# EAGLE design OSSM-M5-Remote_v1 (EAGLE 9.7.0)
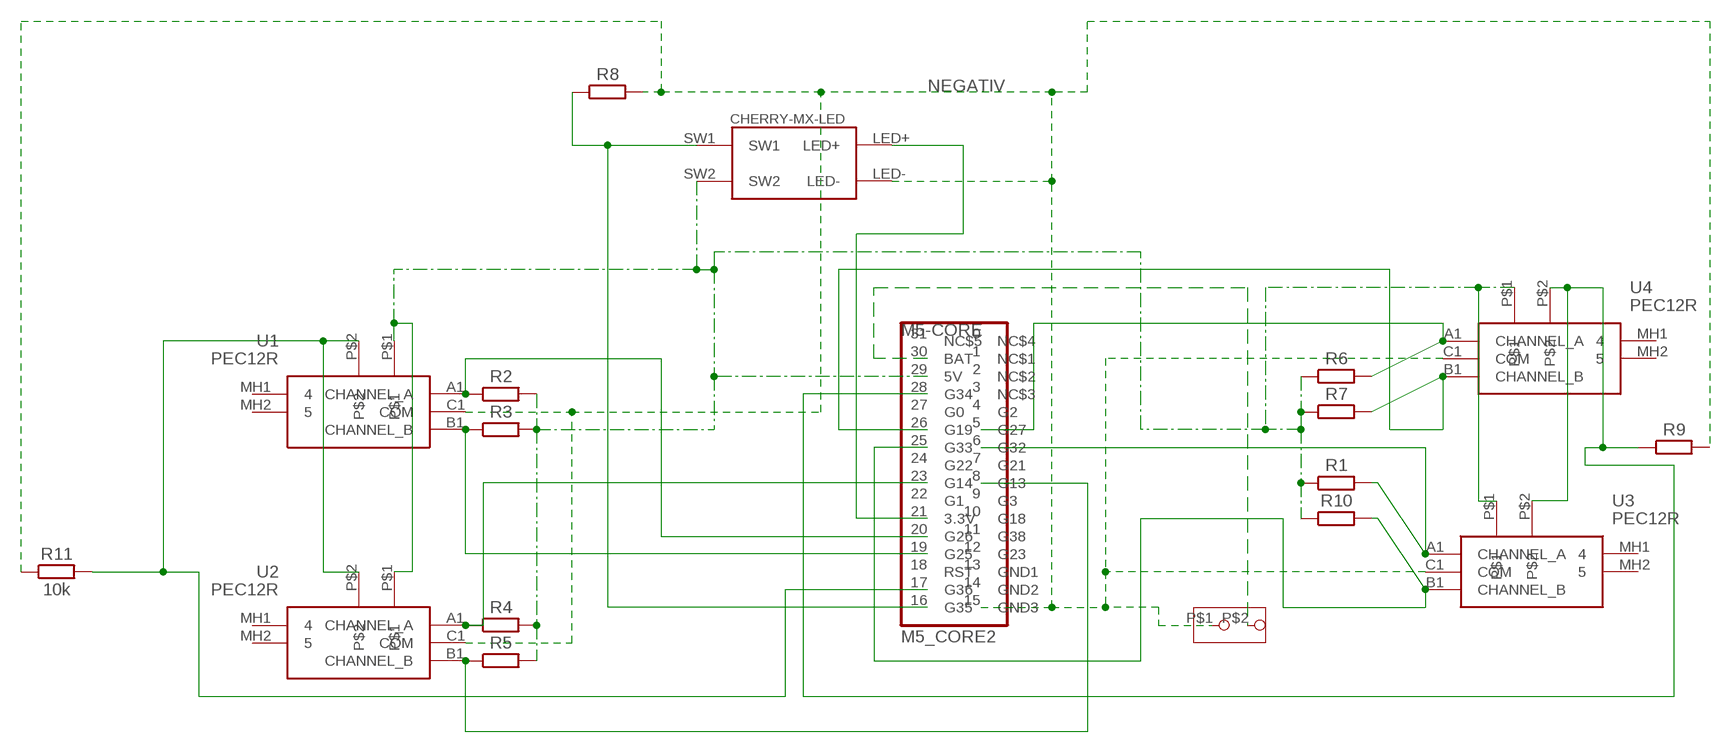
[diagram p0: schematic, sheet 1]

## Parts
M5-CORE  M5_CORE2  [M5_CORE2]
R1  R_CHIP-1206(3216-METRIC)  [RESC3216X70]
R2  R_CHIP-1206(3216-METRIC)  [RESC3216X70]
R3  R_CHIP-1206(3216-METRIC)  [RESC3216X70]
R4  R_CHIP-1206(3216-METRIC)  [RESC3216X70]
R5  R_CHIP-1206(3216-METRIC)  [RESC3216X70]
R6  R_CHIP-1206(3216-METRIC)  [RESC3216X70]
R7  R_CHIP-1206(3216-METRIC)  [RESC3216X70]
R8  R_CHIP-1206(3216-METRIC)  [RESC3216X70]
R9  R_CHIP-1206(3216-METRIC)  [RESC3216X70]
R10  R_CHIP-1206(3216-METRIC)  [RESC3216X70]
R11  10k  R_CHIP-1206(3216-METRIC)  [RESC3216X70]
U1  PEC12R  PEC12R-4230F-N0024  [PEC12R4017FN0024]
U2  PEC12R  PEC12R-4230F-N0024  [PEC12R4017FN0024]
U3  PEC12R  PEC12R-4230F-N0024  [PEC12R4017FN0024]
U4  PEC12R  PEC12R-4230F-N0024  [PEC12R4017FN0024]
U$3  JST-PH-2MM,180  [JST-PH-2.0MM_180DEGREES]
U$4  CHERRY-MX-LED  [CHERRY-MX-LED]

## Nets
+5V [Power]: M5-CORE.29(5V) R1.1 R2.2 R3.2 R4.2 R5.2 R6.1 R7.1 R10.1 U1.P$1 U2.P$1 U3.P$1 U4.P$1 U$4.SW2
BAT+ [Power]: M5-CORE.30(BAT) U$3.P$2
N$3: M5-CORE.21(3.3V) U$4.LED+
N$5: M5-CORE.20(G26) R2.1 U1.A1(CHANNEL_A)
N$6: M5-CORE.19(G25) R3.1 U1.B1(CHANNEL_B)
N$8: M5-CORE.23(G14) R4.1 U2.A1(CHANNEL_A)
N$10: M5-CORE.8(G13) R5.1 U2.B1(CHANNEL_B)
N$11: M5-CORE.5(G27) R6.2 U4.A1(CHANNEL_A)
N$12: M5-CORE.26(G19) R7.2 U4.B1(CHANNEL_B)
N$13: M5-CORE.6(G32) R1.2 U3.A1(CHANNEL_A)
N$14: M5-CORE.25(G33) R10.2 U3.B1(CHANNEL_B)
N$26: M5-CORE.17(G36) R11.2 U1.P$2 U2.P$2
N$27: M5-CORE.28(G34) R9.1 U3.P$2 U4.P$2
N$31: M5-CORE.16(G35) R8.1 U$4.SW1
NEGATIV [Power]: M5-CORE.15(GND3) R8.2 R9.2 R11.1 U1.C1(COM) U2.C1(COM) U3.C1(COM) U4.C1(COM) U$3.P$1 U$4.LED-
Unconnected: M5-CORE.0(NC$4) M5-CORE.1(NC$1) M5-CORE.2(NC$2) M5-CORE.3(NC$3) M5-CORE.4(G2) M5-CORE.7(G21) M5-CORE.9(G3) M5-CORE.10(G18) M5-CORE.11(G38) M5-CORE.12(G23) M5-CORE.13(GND1) M5-CORE.14(GND2) M5-CORE.18(RST) M5-CORE.22(G1) M5-CORE.24(G22) M5-CORE.27(G0) M5-CORE.31(NC$5) U1.MH1 U1.MH2 U2.MH1 U2.MH2 U3.MH1 U3.MH2 U4.MH1 U4.MH2

## Library data of the parts
M5-CORE = M5-Core:M5_CORE2
R1-R11 = Resistor:R: Resistor Fixed - Generic; CATEGORY: Resistor; SUB-CATEGORY: Fixed
U1 = PEC12R-4230F-N0024:PEC12R-4230F-N0024: Encoders HORZ 24DET 24PULSE 30mm SHAFT W/O SW Source: Datasheet <https://www.bourns.com/docs/Product-Datasheets/PEC12R.pdf>; ARROW_PRICE-STOCK: https://www.arrow.com/en/products/pec12r-4230f-n0024/bourns; HEIGHT: 17.5mm; MANUFACTURER_NAME: Bourns; MOUSER_PRICE-STOCK: https://www.mouser.co.uk/ProductDetail/Bourns/PEC12R-4230F-N0024?qs=Zq5ylnUbLm5pfnEk8CuZjg%3D%3D
U2-U4 = PEC12R-4230F-N0024:PEC12R-4230F-N0024: Encoders HORZ 24DET 24PULSE 30mm SHAFT W/O SW Source: Datasheet <https://www.bourns.com/docs/Product-Datasheets/PEC12R.pdf>; ARROW_PART_NUMBER: PEC12R-4230F-N0024; ARROW_PRICE-STOCK: https://www.arrow.com/en/products/pec12r-4230f-n0024/bourns; DESCRIPTION: Encoders HORZ 24DET 24PULSE 30mm SHAFT W/O SW; HEIGHT: 17.5mm; MANUFACTURER_NAME: Bourns; MANUFACTURER_PART_NUMBER: PEC12R-4230F-N0024; MOUSER_PART_NUMBER: 652-PEC12R-4230F-N24; MOUSER_PRICE-STOCK: https://www.mouser.co.uk/ProductDetail/Bourns/PEC12R-4230F-N0024?qs=Zq5ylnUbLm5pfnEk8CuZjg%3D%3D
U$3 = Vampix_Bauteile:JST-PH-2MM,180
U$4 = cherrymx:CHERRY-MX-LED: Cherry MX series keyswitch with LED

## Net classes
0 default: width 0.2 mm, drill 0.3 mm, clearance 0.2 mm
1 Power: width 0.4 mm, drill 0.6 mm, clearance 0.2 mm

## Board
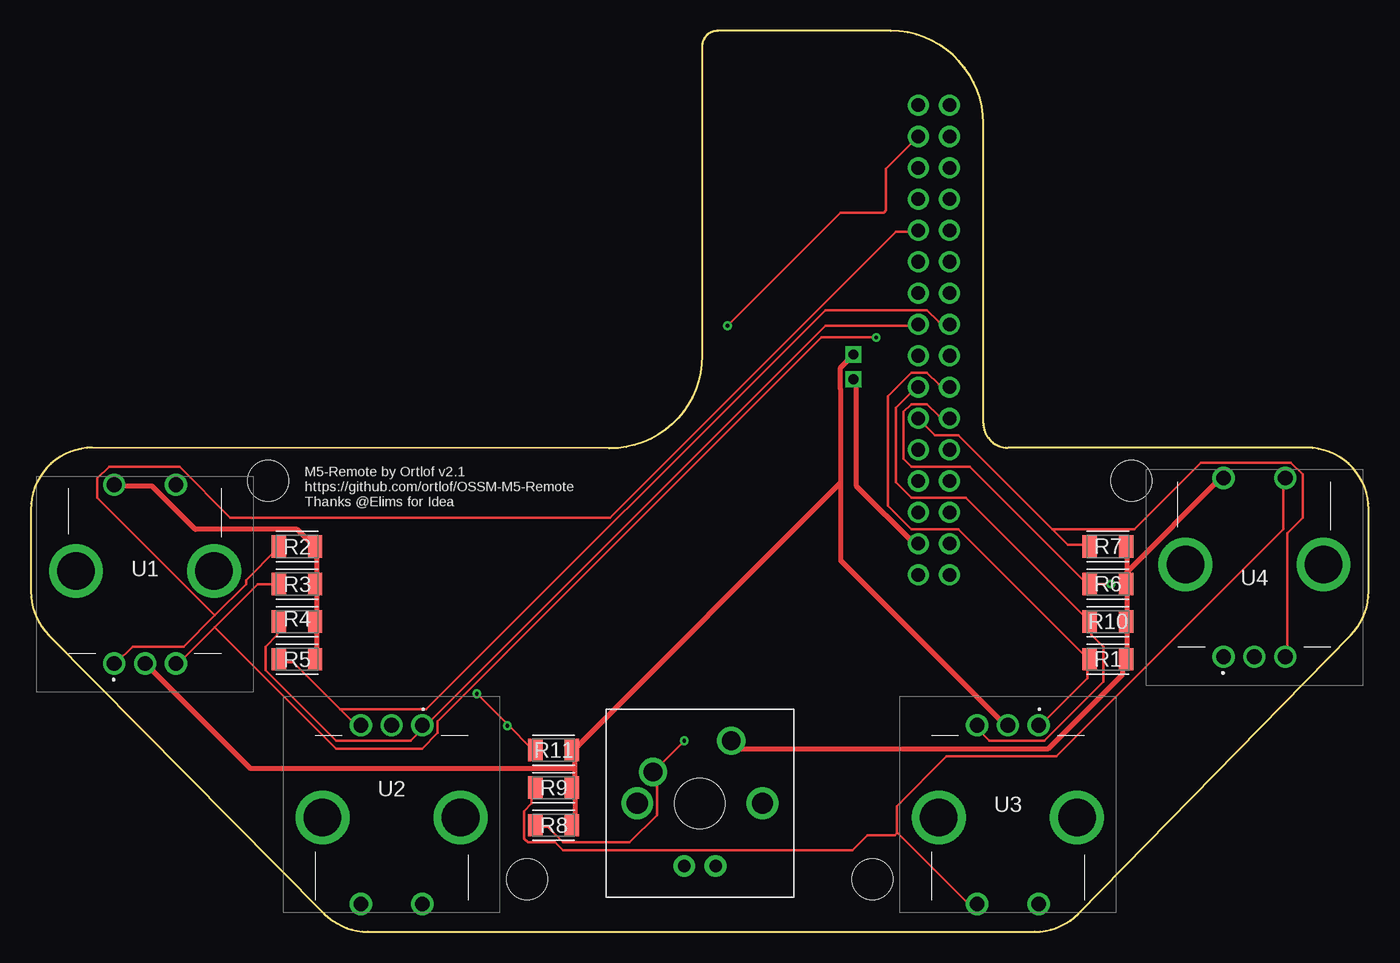
[diagram p1: board, top side]
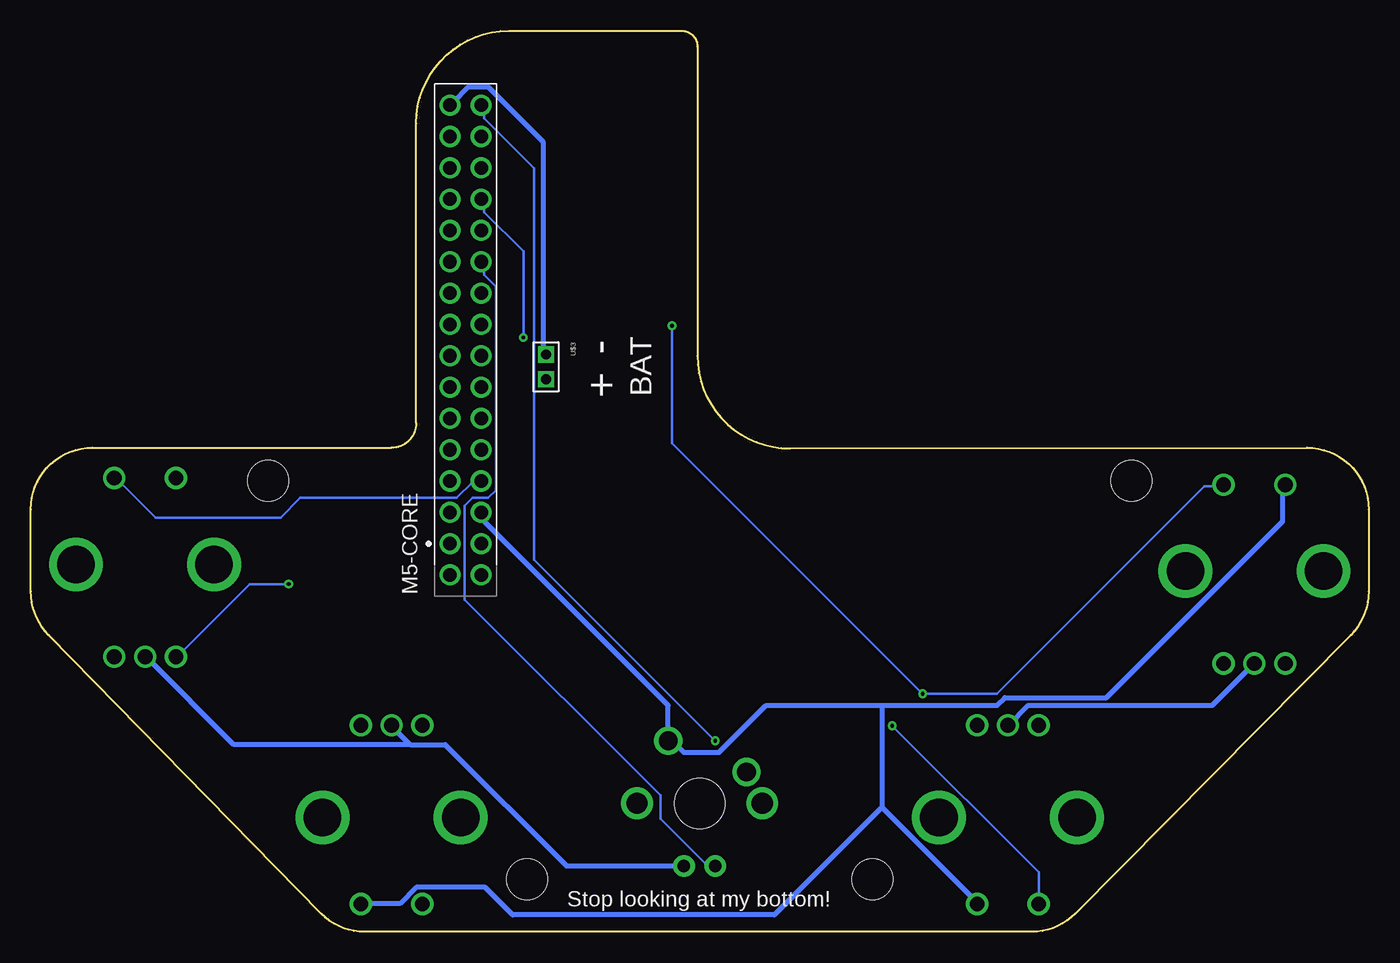
[diagram p2: board, bottom side, seen from below]

Size 108.54 x 73.06 mm. Coordinates in mm from the lower left corner, seen from the top.
Outline: 77.27,41.25 77.27,65.56 arc90 69.77,73.06 55.73,73.06 arc90 54.46,71.79 54.46,46.7 arc-90 46.95,39.2 5,39.25 arc90 0,34.25 0,27.6 arc45 1.46,24.06 23.81,1.46 arc45 27.34,0 81.45,0 arc45 84.99,1.46 107.08,24.06 arc45 108.54,27.6 108.54,34.25 arc90 103.54,39.25 79.27,39.25 arc-90 77.27,41.25
Copper layers (1*16): Top 0.035mm / dielectric 1mm / Bottom 0.035mm
Design rules "default *": minimum track width 8mil, minimum drill 0.3mm, track to track 8mil, track to pad 8mil, pad to pad 8mil, via to via 8mil, smd to smd 8mil, copper to edge 40mil, drill to drill 6mil, minimum pad ring 10mil, minimum via ring 8mil, stop-mask expansion 4mil, vias tented up to drill 0mil, thermal gap 10mil
Holes 3.3 mm at 40.27,4.25 68.27,4.25 19.27,36.59 89.27,36.59

### Footprints (pad centres in the part's own frame; a part is rotated, then mirrored left to right if it is on the bottom)
M5_CORE2 = drill 1.105 pad 1.705: 0 -2.54,0; 1 0,0; 2 2.54,0; 3 5.08,0; 4 7.62,0; 5 10.16,0; 6 12.7,0; 7 15.24,0; 8 17.78,0; 9 20.32,0; 10 22.86,0; 11 25.4,0; 12 27.94,0; 13 30.48,0; 14 33.02,0; 15 35.56,0; 16 35.56,-2.54; 17 33.02,-2.54; 18 30.48,-2.54; 19 27.94,-2.54; 20 25.4,-2.54; 21 22.86,-2.54; 22 20.32,-2.54; 23 17.78,-2.54; 24 15.24,-2.54; 25 12.7,-2.54; 26 10.16,-2.54; 27 7.62,-2.54; 28 5.08,-2.54; 29 2.54,-2.54; 30 0,-2.54; 31 -2.54,-2.54
RESC3216X70 = smd 1.165 x 1.815: 1 -1.475,0; 2 1.475,0
PEC12R4017FN0024 = drill 1.2 pad 1.8: A1 0,0; B1 5,0; C1 2.5,0 | drill 3.048 pad 4.35: MH1 -3.1,7.5; MH2 8.1,7.5 | drill 1.2: P$1 0,14.5; P$2 5,14.5
JST-PH-2.0MM_180DEGREES = drill 0.8 square: P$1 0,0; P$2 2,0
CHERRY-MX-LED = drill 1.016 pad 1.778: LED+ -1.27,-5.08; LED- 1.27,-5.08 | drill 1.714 pad 1.93: P$3 -5.08,0; P$4 5.08,0 | drill 1.524 pad 2.286: SW1 -3.81,2.54; SW2 2.54,5.08 | hole 4.064: 0,0

### Placement (x,y rotation side)
M5-CORE  74.54,31.47 90 bottom
R1  87.38,22.1 180 top
R2  21.59,31.24 0 top
R3  21.59,28.19 0 top
R4  21.59,25.15 0 top
R5  21.59,22.1 0 top
R6  87.38,28.19 180 top
R7  87.38,31.24 180 top
R8  42.42,8.64 0 top
R9  42.42,11.68 0 top
R10  87.38,25.15 180 top
R11  42.42,14.73 180 top
U1  6.77,21.75 0 top
U2  31.77,16.75 180 top
U3  81.77,16.75 180 top
U4  96.77,22.29 0 top
U$3  66.74,46.81 270 bottom
U$4  54.28,10.41 0 top

### Tracks (layer width: path | path; a pad name or v marks a point on that pad's centre or on a via)
+5V
  Top 0.4: R5.2 23.18,22.16 23.18,25.02 R4.2 23.18,25.34 23.18,28.19 | 23.18,28.19 23.18,31.05 R2.2 22.86,31.37 21.59,32.64 13.33,32.64 9.84,36.13 6.98,36.13 U1.P$1 | 23.18,28.19 R3.2 | 88.9,29.15 88.9,31.05 R7.1 | 88.9,29.15 88.9,28.19 | 88.9,28.19 88.9,25.34 R10.1 88.9,25.02 88.9,22.16 R1.1 88.58,21.84 88.58,20.89 82.55,14.86 57.47,14.86 56.83,15.49 U$4.SW2 | 88.9,28.19 R6.1 | 88.9,29.15 96.52,36.77 U4.P$1
  Bottom 0.4: M5-CORE.29 71.75,33.91 71.75,33.27 56.83,18.35 56.83,15.49 U$4.SW2 56.52,15.49 55.56,14.54 52.71,14.54 48.9,18.35 39.47,18.35 | 39.47,18.35 30.16,18.35 29.53,18.99 21.27,18.99 6.98,33.27 6.98,36.13 U1.P$1 | 39.47,10.11 31.85,2.49 31.85,2.29 U2.P$1 | 39.47,18.35 39.47,10.11 | 39.47,10.11 48.21,1.37 69.44,1.37 71.68,3.61 77.27,3.61 78.59,2.29 81.74,2.29 U3.P$1
BAT+
  Top 0.4: U$3.P$2 66.99,44.51 66.99,36.13 71.75,31.37 M5-CORE.30
N$3
  Bottom 0.203: U$4.LED+ 53.66,5.33 57.47,9.14 57.47,11.05 73.34,26.92 73.34,34.54 72.71,35.18 71.44,35.18 70.8,35.81 70.8,52.32 71.75,53.28 71.75,54.23 M5-CORE.21
N$5
  Top 0.203: 14.92,25.65 12.38,23.11 8.26,23.11 6.98,21.84 U1.A1 | 14.92,25.65 17.46,28.19 17.46,28.51 20,31.05 R2.1 | 14.92,25.65 5.4,35.18 5.4,36.77 6.35,37.72 12.06,37.72 16.19,33.59 46.99,33.59 70.17,56.77 71.75,56.77 M5-CORE.20
N$6  (via drill 0.3)
  Top 0.203: R3.1 18.41,28.19 14.92,24.7 | 14.92,24.7 12.06,21.84 U1.B1 | v68.58,48.2 64.14,48.2 33.02,17.08 33.02,16.13 31.75,14.86 24.77,14.86 14.92,24.7
  Bottom 0.203: v68.58,48.2 68.58,55.18 71.75,58.36 71.75,59.31 M5-CORE.19
N$8
  Top 0.203: R4.1 20,25.02 20,24.07 19.05,23.11 19.05,21.21 24.77,15.49 30.8,15.49 31.75,16.45 U2.A1 32.07,16.76 64.45,49.15 71.75,49.15 M5-CORE.23
N$10
  Top 0.203: 25.08,18.03 26.67,16.45 U2.B1 | 25.08,18.03 21.27,21.84 20.32,21.84 R5.1 | 25.08,18.03 32.07,18.03 64.45,50.42 72.71,50.42 73.66,49.47 74.3,49.47 M5-CORE.8
N$11  (via drill 0.3)
  Top 0.203: v87.63,28.19 R6.2 85.72,28.19 76.2,37.72 71.44,37.72 70.8,38.35 70.8,42.16 71.44,42.8 72.71,42.8 73.66,41.85 74.3,41.85 M5-CORE.5
  Bottom 0.203: v87.63,28.19 90.8,28.19 96.52,22.48 U4.A1
N$12
  Top 0.203: 82.87,32.64 75.25,40.26 73.34,40.26 72.07,41.53 M5-CORE.26 | 82.87,32.64 84.14,31.37 85.72,31.37 R7.2 | 82.87,32.64 89.53,32.64 94.93,38.04 102.23,38.04 103.19,37.08 103.19,33.59 101.92,32.32 101.92,22.48 U4.B1
N$13
  Top 0.203: U3.A1 81.91,16.76 85.72,20.57 85.72,21.84 R1.2 85.72,22.16 75.25,32.64 71.44,32.64 69.53,34.54 69.53,43.43 71.44,45.34 72.71,45.34 73.66,44.39 74.3,44.39 M5-CORE.6
N$14
  Top 0.203: U3.B1 76.83,16.45 77.79,15.49 82.23,15.49 86.99,20.26 86.99,23.11 86.04,24.07 86.04,25.02 R10.2 85.72,25.34 75.88,35.18 71.44,35.18 70.17,36.45 70.17,42.48 71.75,44.07 M5-CORE.25
N$26  (via drill 0.3)
  Top 0.203: v36.2,19.3 38.72,16.78 | 38.72,16.78 40.64,14.86 R11.2 | v38.66,16.71 38.72,16.78 | v56.52,49.15 65.69,58.33 69.2,58.33 69.38,58.5 69.38,61.87 M5-CORE.17
  Bottom 0.203: U1.P$2 12.06,36.13 13.33,36.13 30.16,19.3 v36.2,19.3 56.52,39.62 v56.52,49.15 | v38.66,16.71 26.77,4.83 26.77,2.29 U2.P$2
N$27
  Top 0.203: R9.1 40.64,11.68 40.64,10.41 40.01,9.78 40.01,7.56 40.32,7.24 42.55,7.24 43.18,6.6 66.67,6.6 67.89,7.82 70.09,7.82 70.27,8 | U4.P$2 101.6,36.77 101.6,32.64 83.19,14.22 74.3,14.22 70.27,10.2 70.27,8 | U3.P$2 76.76,2.29 76.05,2.29 70.36,7.98 70.27,8
  Bottom 0.203: M5-CORE.28 72.07,36.45 72.71,36.45 73.98,35.18 86.68,35.18 88.27,33.59 98.42,33.59 101.6,36.77 U4.P$2
N$31  (via drill 0.3)
  Top 0.203: 50.48,12.95 50.8,12.64 50.8,9.46 48.58,7.24 43.18,7.24 41.91,8.51 40.96,8.51 R8.1 | 50.48,12.95 v53.02,15.49 | 50.48,12.95 U$4.SW1
  Bottom 0.203: M5-CORE.16 71.75,66.93 71.75,65.98 67.7,61.92 67.7,30.17 v53.02,15.49
NEGATIV
  Top 0.4: 44.13,11.68 44.13,8.83 R8.2 | 44.13,11.68 44.13,13.27 | 44.13,13.27 44.13,14.54 R11.1 44.13,14.86 65.72,36.45 | 44.13,11.68 R9.2 | 44.13,13.27 17.78,13.27 9.53,21.53 U1.C1 | 65.72,36.45 65.72,30.1 79.06,16.76 U3.C1 | 65.72,36.45 65.72,43.95 65.69,43.99 65.69,45.75 U$3.P$1
  Bottom 0.4: U1.C1 9.53,21.53 12.7,18.35 27.62,18.35 29.21,16.76 U2.C1 | U$3.P$1 66.99,47.05 66.99,64.07 71.44,68.52 73.02,68.52 74.3,67.25 M5-CORE.15 | U$4.LED- 65.09,5.33 74.93,15.18 77.79,15.18 | 77.79,15.18 79.06,16.45 U3.C1 | 77.79,15.18 92.08,15.18 99.06,22.16 U4.C1

### Text on the board
Top: 
tPlace: 
tNames: M5-Remote by Ortlof v2.1 / https://github.com/ortlof/OSSM-M5-Remote / Thanks @Elims for Idea
bNames: - | BAT | + | Stop looking at my bottom!